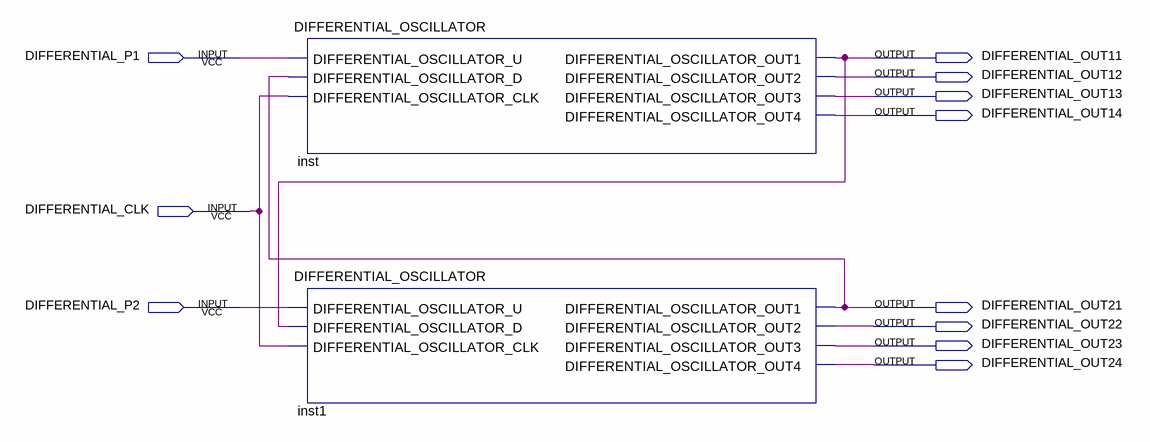
[diagram p0: schematic sheet]
// Quartus schematic DIFFERENTIAL.bdf as structural Verilog: 2 symbols, 11 pins
module DIFFERENTIAL (
  input  DIFFERENTIAL_P1,
  input  DIFFERENTIAL_CLK,
  input  DIFFERENTIAL_P2,
  output DIFFERENTIAL_OUT11,
  output DIFFERENTIAL_OUT12,
  output DIFFERENTIAL_OUT13,
  output DIFFERENTIAL_OUT14,
  output DIFFERENTIAL_OUT21,
  output DIFFERENTIAL_OUT22,
  output DIFFERENTIAL_OUT23,
  output DIFFERENTIAL_OUT24
);

  DIFFERENTIAL_OSCILLATOR inst (
    .DIFFERENTIAL_OSCILLATOR_U(DIFFERENTIAL_P1), .DIFFERENTIAL_OSCILLATOR_D(DIFFERENTIAL_OUT21),
    .DIFFERENTIAL_OSCILLATOR_CLK(DIFFERENTIAL_CLK), .DIFFERENTIAL_OSCILLATOR_OUT1(DIFFERENTIAL_OUT11),
    .DIFFERENTIAL_OSCILLATOR_OUT2(DIFFERENTIAL_OUT12), .DIFFERENTIAL_OSCILLATOR_OUT3(DIFFERENTIAL_OUT13),
    .DIFFERENTIAL_OSCILLATOR_OUT4(DIFFERENTIAL_OUT14));
  DIFFERENTIAL_OSCILLATOR inst1 (
    .DIFFERENTIAL_OSCILLATOR_U(DIFFERENTIAL_P2), .DIFFERENTIAL_OSCILLATOR_D(DIFFERENTIAL_OUT11),
    .DIFFERENTIAL_OSCILLATOR_CLK(DIFFERENTIAL_CLK), .DIFFERENTIAL_OSCILLATOR_OUT1(DIFFERENTIAL_OUT21),
    .DIFFERENTIAL_OSCILLATOR_OUT2(DIFFERENTIAL_OUT22), .DIFFERENTIAL_OSCILLATOR_OUT3(DIFFERENTIAL_OUT23),
    .DIFFERENTIAL_OSCILLATOR_OUT4(DIFFERENTIAL_OUT24));
endmodule
